# EAGLE schematic dual-m0dul (EAGLE 5.11)
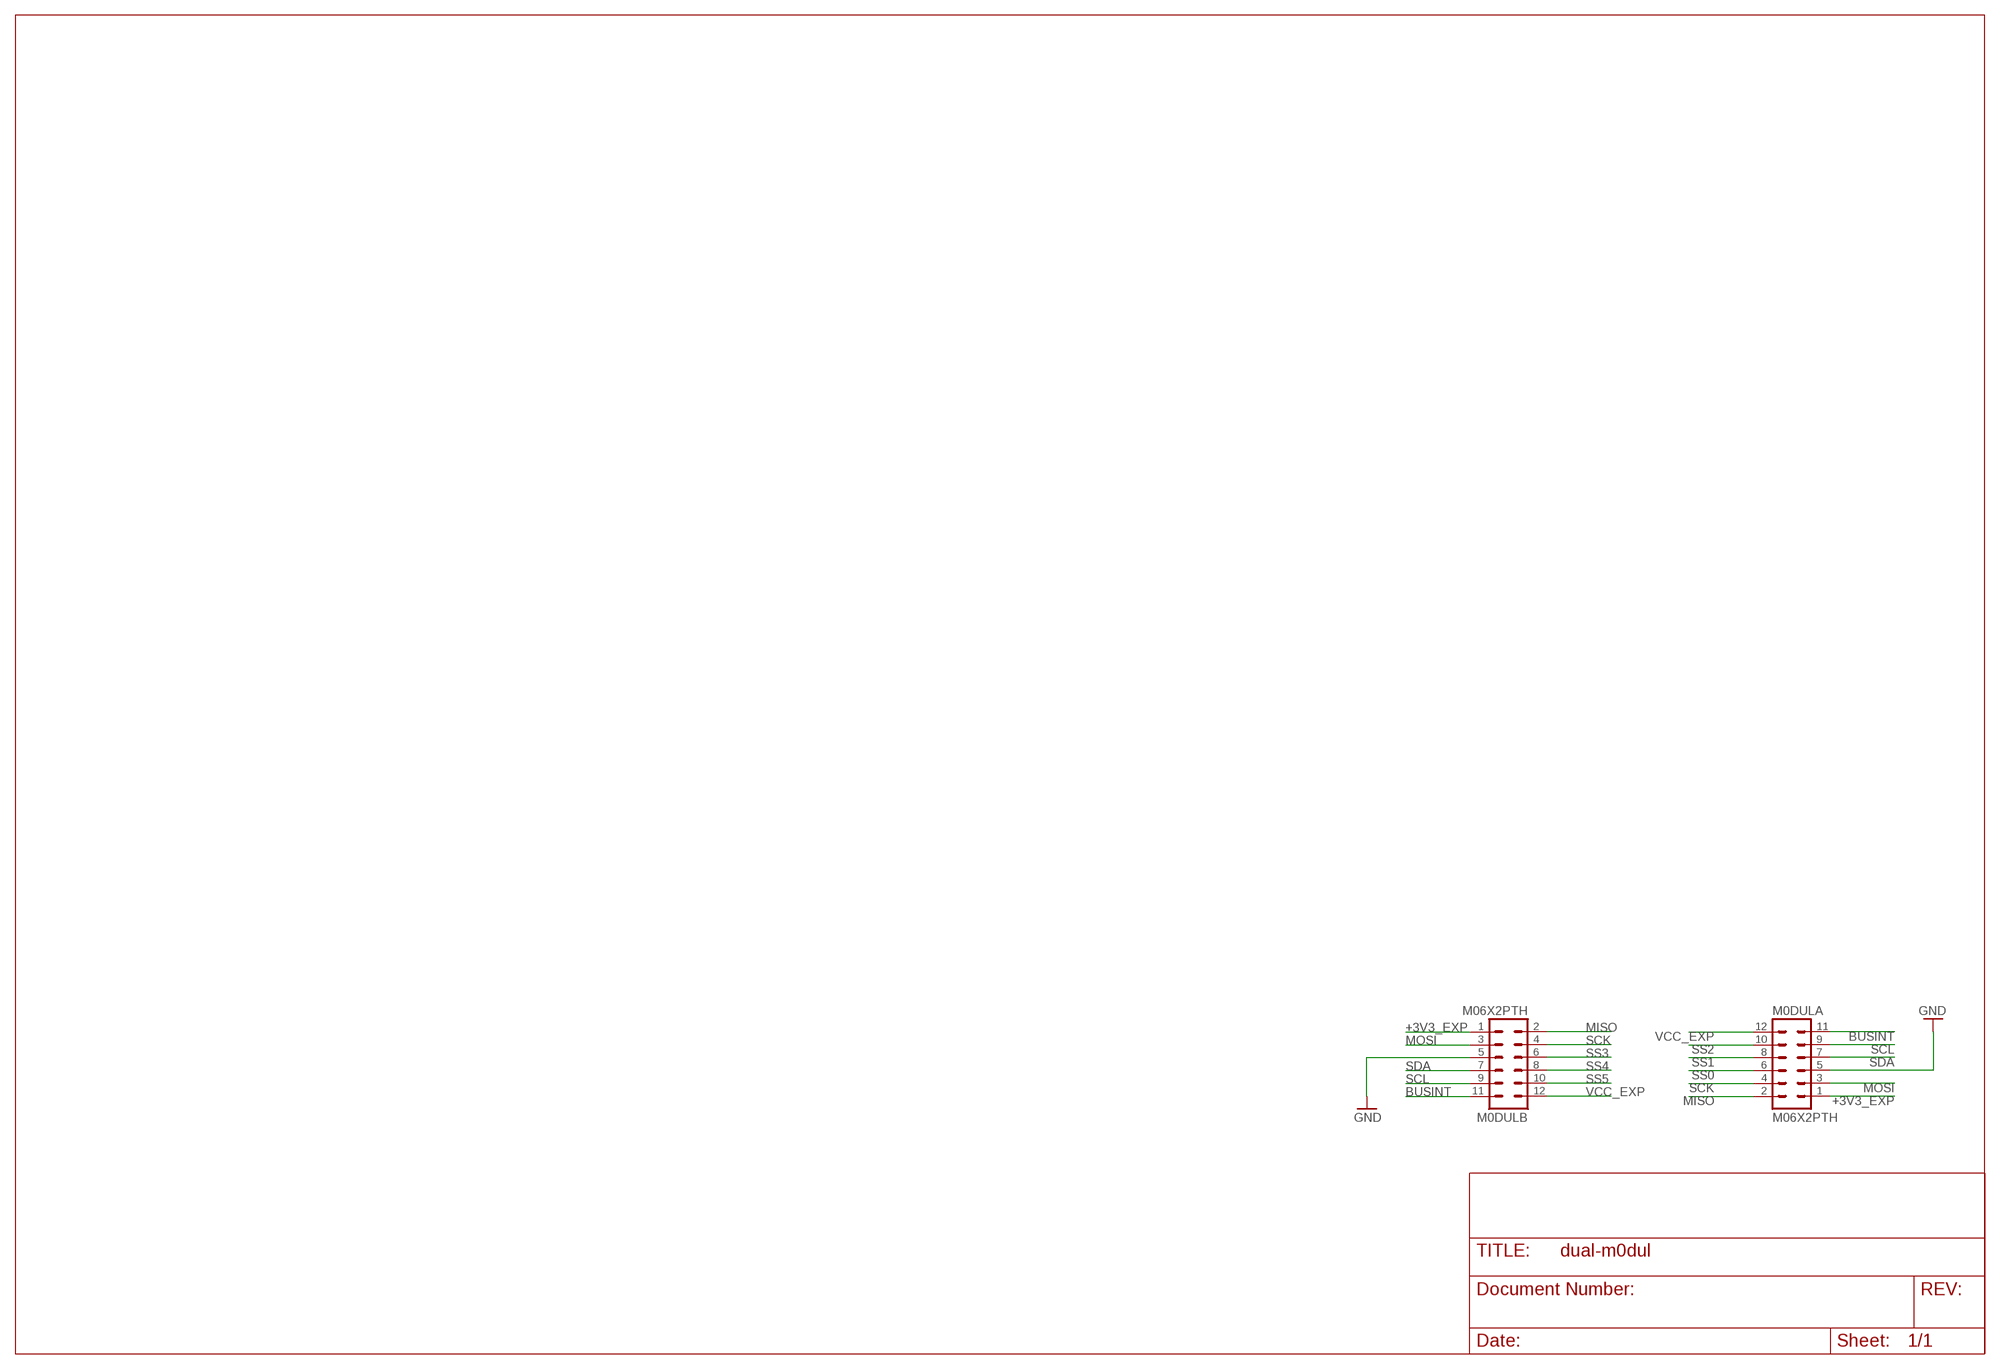
[diagram p0: schematic, sheet 1]

## Parts
M0DULA  M06X2PTH  MA06-2  [MA06-2]
M0DULB  M06X2PTH  MA06-2  [MA06-2]

## Nets
+3V3_EXP [FAT]: M0DULA.1 M0DULB.1
BUSINT: M0DULA.11 M0DULB.11
GND [GND/3V3]: M0DULA.5 M0DULB.5
MISO: M0DULA.2 M0DULB.2
MOSI: M0DULA.3 M0DULB.3
SCK: M0DULA.4 M0DULB.4
SCL: M0DULA.9 M0DULB.9
SDA: M0DULA.7 M0DULB.7
SS0: M0DULA.6
SS1: M0DULA.8
SS2: M0DULA.10
SS3: M0DULB.6
SS4: M0DULB.8
SS5: M0DULB.10
VCC_EXP [FAT]: M0DULA.12 M0DULB.12

## Library data of the parts
M0DULA M0DULB = con-lstb:MA06-2: PIN HEADER; OC_FARNELL: unknown; OC_NEWARK: unknown

## Net classes
1 FAT: width 0.2 mm, drill 0.4 mm
2 GND/3V3: width 0.2 mm, drill 0.4 mm